# EAGLE design adc_dac_breakout (EAGLE 9.4.2)
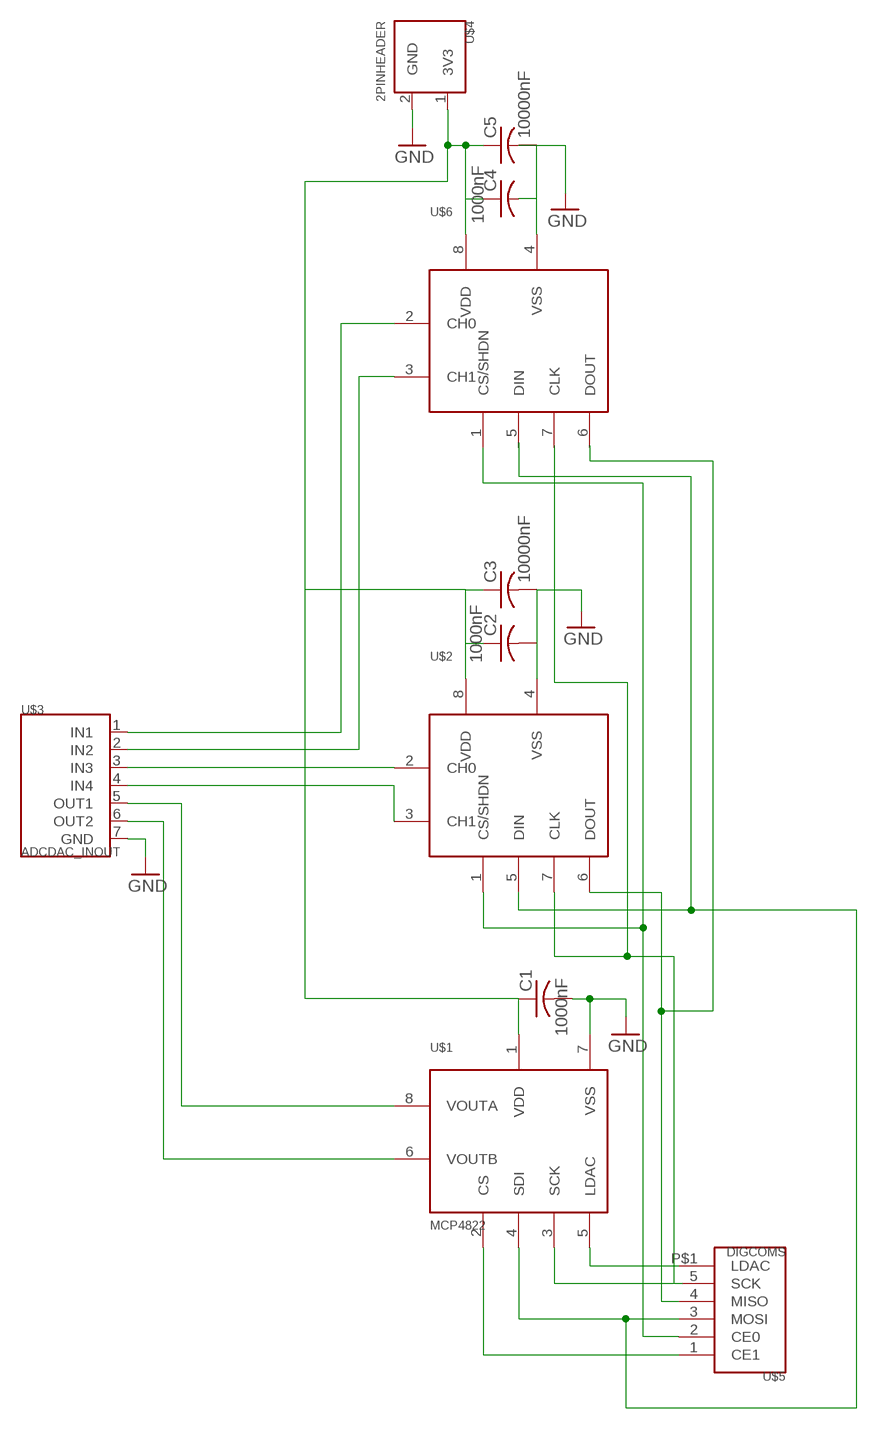
[diagram p0: schematic, sheet 1]

## Parts
C1  1000nF  C-USC0603  [C0603]
C2  1000nF  C-USC0603  [C0603]
C3  10000nF  C-USC0603  [C0603]
C4  1000nF  C-USC0603  [C0603]
C5  10000nF  C-USC0603  [C0603]
U$1  MCP4822  [MCP4822]
U$2  MCP3202  [MCP3202]
U$3  ADCDAC_INOUT  [7PINHEADER]
U$4  2PINHEADER  [2PINHEADER]
U$5  DIGCOMS  [6PINHEADER]
U$6  MCP3202  [MCP3202]

## Nets
GND: C1.2 U$1.7(VSS) U$3.7(GND) U$4.2(GND)
N$1: U$1.2(CS) U$5.1(CE1)
N$2: U$1.8(VOUTA) U$3.5(OUT1)
N$3: U$1.6(VOUTB) U$3.6(OUT2)
N$4: U$1.4(SDI) U$2.5(DIN) U$5.3(MOSI)
N$5: U$1.3(SCK) U$5.5(SCK)
N$6: U$1.5(LDAC) U$5.P$1(LDAC)
N$7: U$2.1(CS/SHDN) U$5.2(CE0) U$6.1(CS/SHDN)
N$8: C2.2 C3.2 U$2.4(VSS) ; supply symbol labelled GND
N$9: U$2.3(CH1) U$3.4(IN4)
N$10: C4.2 C5.2 U$6.4(VSS) ; supply symbol labelled GND
N$11: U$2.2(CH0) U$3.3(IN3)
N$12: U$3.2(IN2) U$6.3(CH1)
N$13: U$3.1(IN1) U$6.2(CH0)
N$15: U$2.6(DOUT) U$5.4(MISO)
N$17: U$2.7(CLK) U$6.7(CLK)
N$20: C1.1 C2.1 C3.1 C4.1 C5.1 U$1.1(VDD) U$2.8(VDD) U$4.1(3V3) U$6.8(VDD)
Unconnected: U$6.5(DIN) U$6.6(DOUT)

## Library data of the parts
C1-C5 = rcl:C-US: CAPACITOR, American symbol; SPICEPREFIX: C
U$1 = seds:MCP4822
U$2 U$6 = seds:MCP3202
U$3 = seds:ADCDAC_INOUT
U$4 = seds:2PINHEADER
U$5 = seds:DIGCOMS

## Board
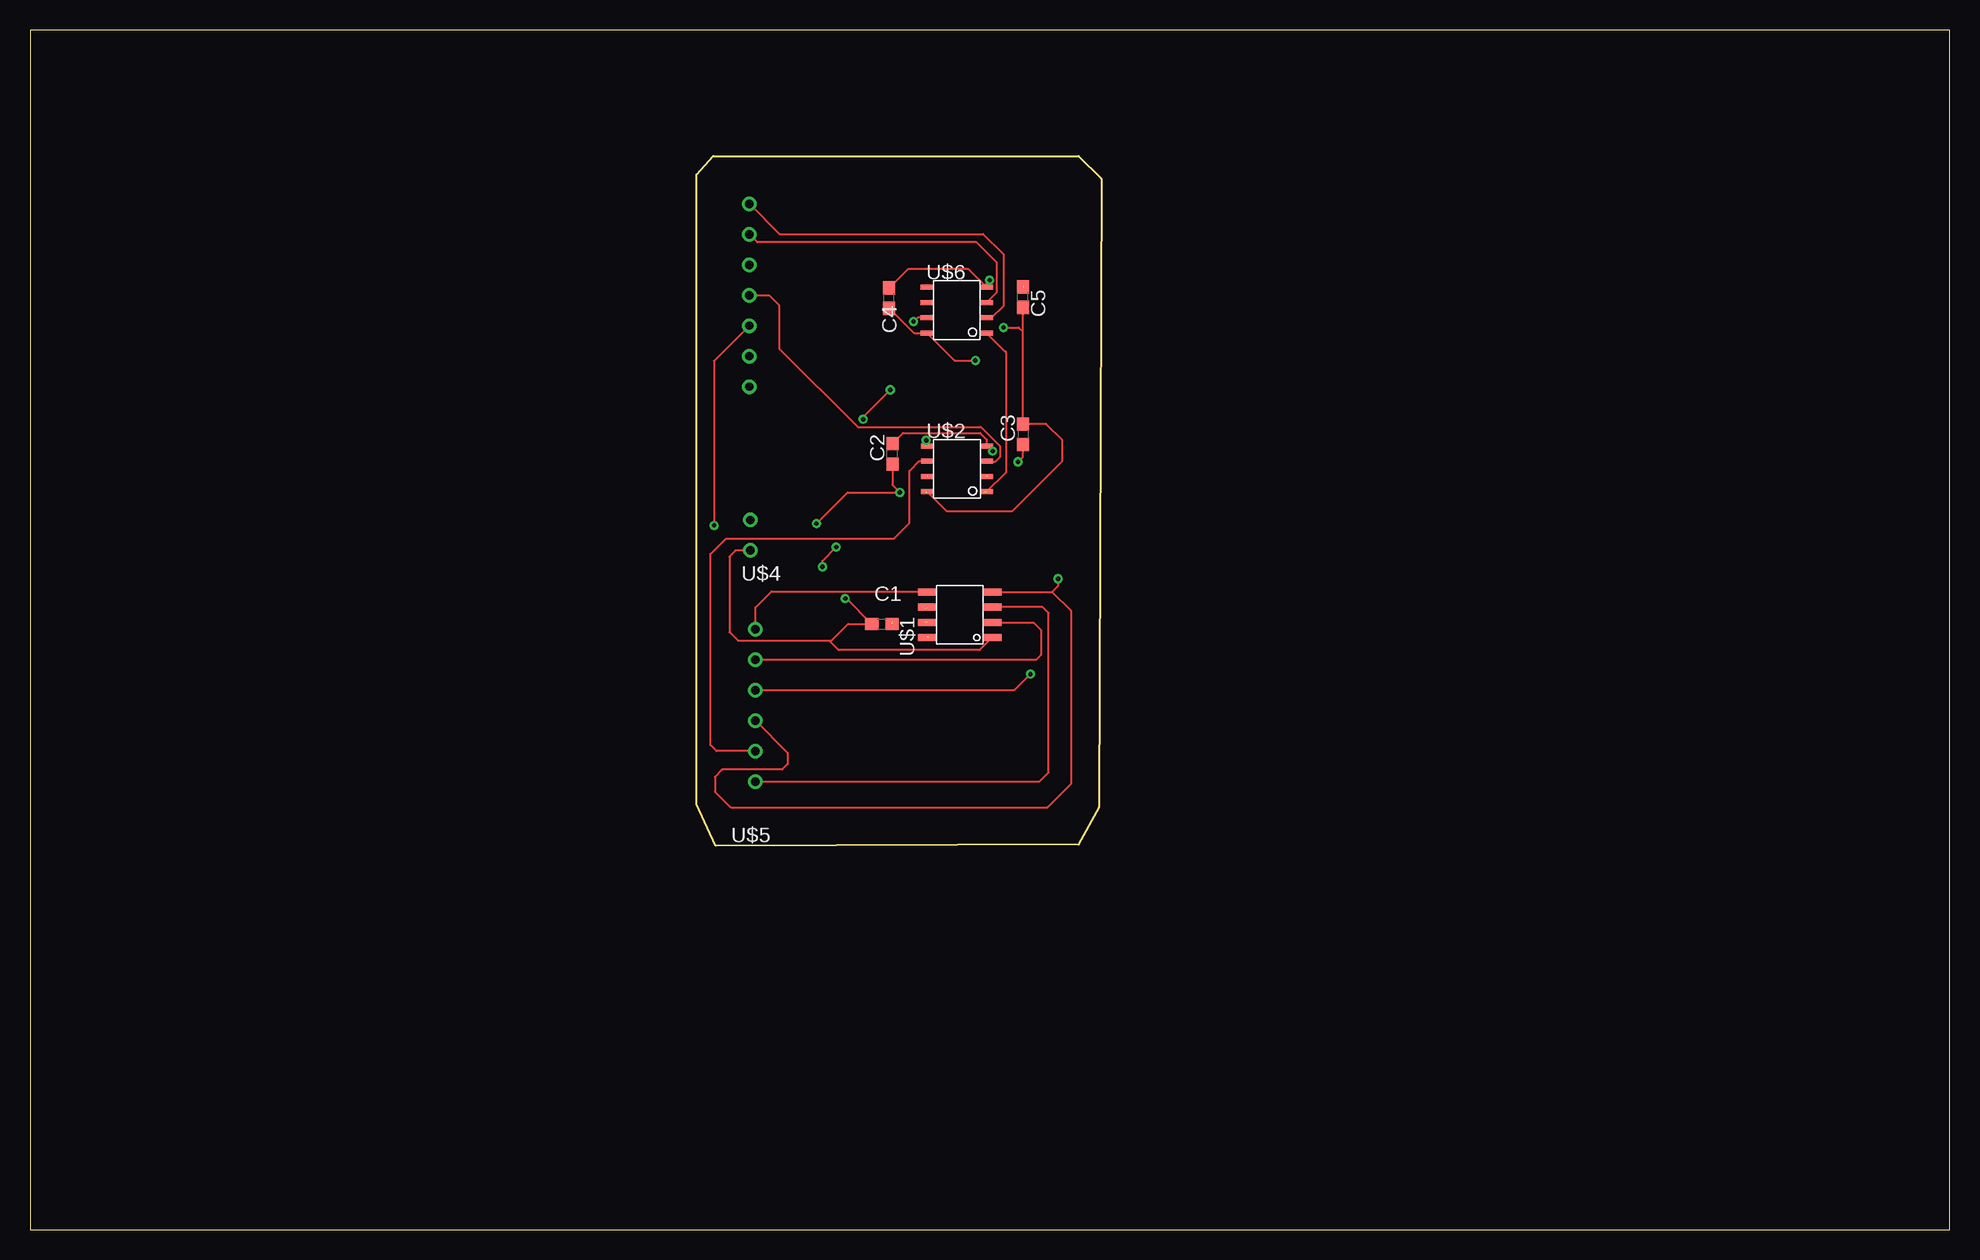
[diagram p1: board, top side]
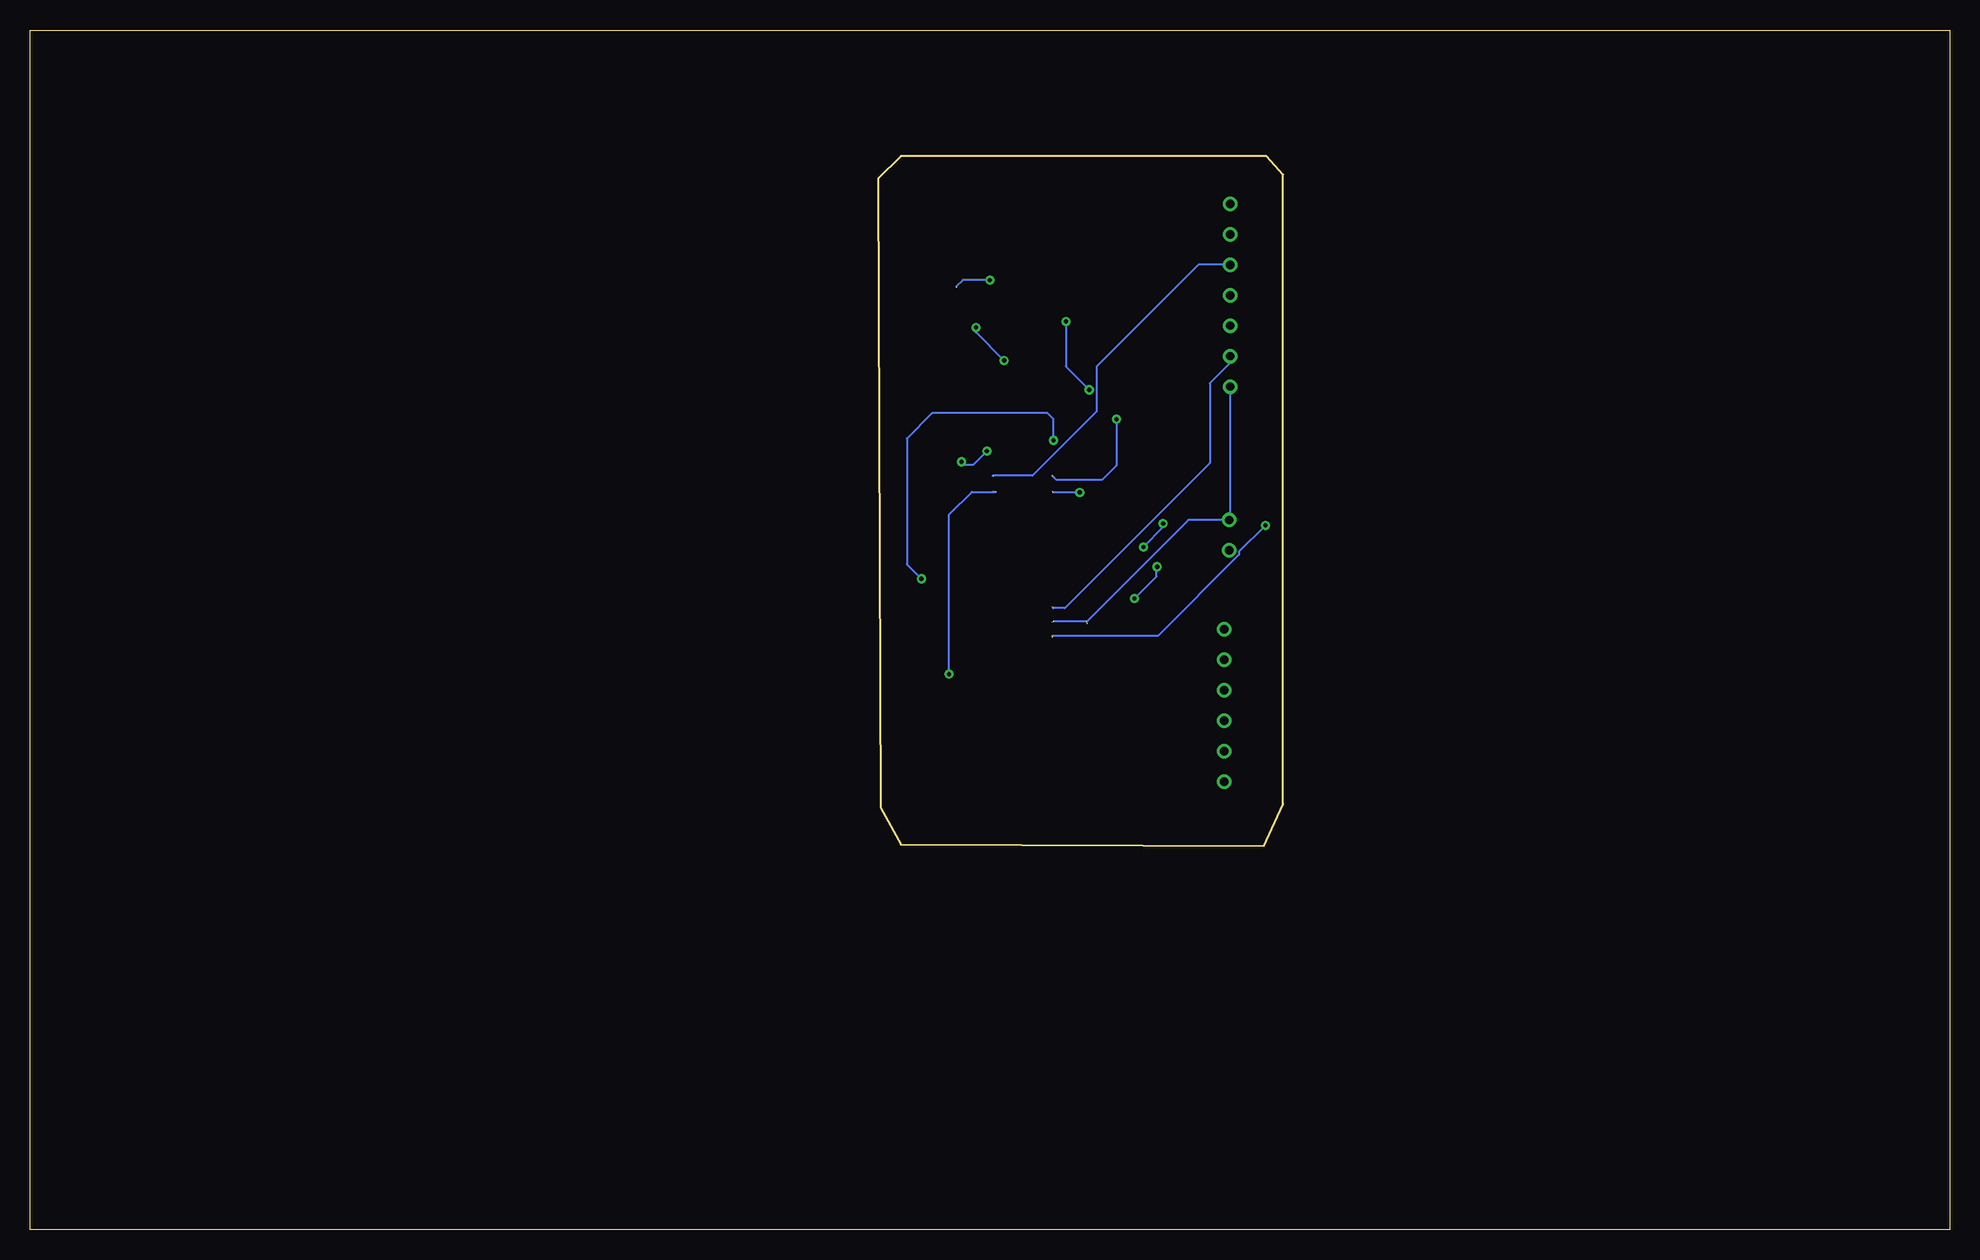
[diagram p2: board, bottom side, seen from below]

Size 160 x 100 mm. Coordinates in mm from the lower left corner, seen from the top.
Outline: 0,0 160,0 160,100 0,100 0,0
Outline: 56.95,89.5 87.4,89.5 89.3,87.6 89.1,35.2 87.4,32.1 57.15,32 55.55,35.45 55.55,87.95 56.95,89.5
Copper layers (1*16): Top 0.035mm / dielectric 1.5mm / Bottom 0.035mm
Design rules "default": minimum track width 6mil, minimum drill 0.35mm, track to track 6mil, track to pad 6mil, pad to pad 6mil, via to via 6mil, smd to smd 6mil, copper to edge 40mil, drill to drill 6mil, minimum pad ring 10mil, minimum via ring 8mil, stop-mask expansion 4mil, vias tented up to drill 0mil, thermal gap 10mil

### Footprints (pad centres in the part's own frame; a part is rotated, then mirrored left to right if it is on the bottom)
C0603 = smd 1.1 x 1: 1 -0.85,0; 2 0.85,0
MCP4822 = smd 0.6 x 1.55: 1 -1.905,-2.7; 2 -0.635,-2.7; 3 0.635,-2.7; 4 1.905,-2.7; 5 1.905,2.7; 6 0.635,2.7; 7 -0.635,2.7; 8 -1.905,2.7
MCP3202 = smd 1.055 x 0.42: 1 2.482,-1.905; 2 2.482,-0.635; 3 2.482,0.635; 4 2.482,1.905; 5 -2.482,1.905; 6 -2.482,0.635; 7 -2.482,-0.635; 8 -2.482,-1.905
7PINHEADER = drill 0.7: 1 0,5.08; 2 0,2.54; 3 0,0; 4 0,-2.54; 5 0,-5.08; 6 0,-7.62; 7 0,-10.16
2PINHEADER = drill 0.7: 1 0,2.54; 2 0,0
6PINHEADER = drill 0.7: 1 0,5.08; 2 0,2.54; 3 0,0; 4 0,-2.54; 5 0,-5.08; P$1 0,7.62

### Placement (x,y rotation side)
C1  71.01,50.48 0 top
C2  71.88,64.67 90 top
C3  82.76,66.3 270 top
C4  71.62,77.65 90 top
C5  82.75,77.73 90 top
U$1  77.5,51.25 90 top
U$2  77.26,63.42 0 top
U$3  59.97,80.43 0 top
U$4  60.05,59.15 180 top
U$5  60.47,42.42 0 top
U$6  77.25,76.65 0 top

### Tracks (layer width: path | path; a pad name or v marks a point on that pad's centre or on a via)
GND  (2 unrouted)
  Bottom 0.152: 74.65,50.7 71.9,50.7 63.45,59.15 U$4.2 59.97,59.23 U$3.7
N$1
  Top 0.152: U$1.2 80.22,50.6 83.65,50.6 84.25,50 84.25,47.9 83.85,47.5 U$5.1
N$2  (via drill 0.35)  (1 unrouted)
  Top 0.152: U$3.5 57.02,72.4 v57.02,58.7
  Bottom 0.152: v57.02,58.7 59.22,56.5 59.22,56.27 65.98,49.5 74.8,49.5
N$3  (1 unrouted)
  Bottom 0.152: U$3.6 59.97,72.23 61.65,70.55 61.65,63.9 73.75,51.8 74.7,51.8
N$4  (via drill 0.35)
  Top 0.152: U$1.4 85.19,53.16 | 85.19,53.16 86.8,51.55 86.8,37.2 84.8,35.2 58.4,35.2 57.1,36.5 57.1,37.75 57.7,38.35 62.7,38.35 63.15,38.8 63.15,39.74 U$5.3 | U$2.5 74.78,65.72 v74.7,65.79 | v85.7,54.25 85.7,53.66 85.19,53.16
  Bottom 0.152: v74.7,65.79 74.7,67.55 75.2,68.05 84.8,68.05 86.9,65.95 86.9,55.45 v85.7,54.25
N$5
  Top 0.152: U$5.5 84.14,37.34 84.9,38.1 84.9,51.4 84.42,51.88 U$1.3
N$6
  Top 0.152: U$5.P$1 60.47,51.87 61.8,53.2 74.75,53.2 U$1.5
N$7  (via drill 0.35)  (1 unrouted)
  Top 0.152: U$2.1 81.35,63.12 81.35,73.2 81.28,73.2 U$6.1 | U$5.2 82.06,44.96 v83.4,46.3
  Bottom 0.152: v83.4,46.3 83.4,59.6 81.5,61.5 79.5,61.5
N$8  (via drill 0.35)
  Top 0.152: C2.2 72.76,66.4 79.2,66.4 79.74,65.86 U$2.4 80.17,64.9 v80.24,64.9 | C3.2 82.76,64.41 v82.35,64
  Bottom 0.152: v80.24,64.9 81.39,63.75 82.1,63.75 v82.35,64
N$9
  Top 0.152: U$3.4 61.61,77.89 62.45,77.05 62.45,73.45 69,66.9 79.25,66.9 80.85,65.3 80.85,64.4 80.45,64 79.8,64 U$2.3
N$10  (via drill 0.35)  (1 unrouted)
  Top 0.152: C4.2 73.22,80.1 78.19,80.1 U$6.4 79.73,78.89 v79.99,79.15
  Bottom 0.152: v79.99,79.15 82.25,79.15 82.8,78.6
N$11  (1 unrouted)
  Bottom 0.152: U$3.3 62.62,80.43 71.1,71.95 71.1,68.2 76.45,62.85 79.75,62.85
N$12
  Top 0.152: U$6.3 80.6,78.15 80.6,80.6 78.9,82.3 60.64,82.3 U$3.2
N$13
  Top 0.152: U$3.1 62.48,83 79.45,83 81.15,81.3 81.15,77 80.17,76.02 U$6.2
N$15
  Top 0.152: U$5.4 57.22,39.88 56.72,40.38 56.72,56.32 58,57.6 72,57.6 73.3,58.9 73.3,63.25 74.11,64.06 U$2.6
N$17  (via drill 0.35)  (1 unrouted)
  Top 0.152: U$6.7 73.97,76.02 v73.65,75.7 | v71.71,70 69.45,67.74 v69.45,67.55
  Bottom 0.152: v73.65,75.7 73.65,71.94 v71.71,70 | v69.45,67.55 69.45,63.7 70.65,62.5 74.45,62.5 74.8,62.85
N$20  (via drill 0.35)  (1 unrouted)
  Top 0.152: U$4.1 58.81,56.61 58.3,56.1 58.3,49.8 59,49.1 66.6,49.1 | 66.6,49.1 66.8,49.1 68.2,50.5 70.14,50.5 | C1.1 70.14,50.5 | U$1.1 79.16,48.3 67.4,48.3 66.6,49.1 | C4.1 73.67,74.75 U$6.8 77.06,72.45 v78.8,72.45 | 82.75,74.85 C3.1 84.7,67.15 86.05,65.8 86.05,64.05 81.9,59.9 76.39,59.9 U$2.8 | 82.75,74.85 C5.1 | C2.1 71.88,62.07 v72.5,61.45 68.15,61.45 v65.55,58.85 | v81.15,75.2 82.4,75.2 82.75,74.85 | 70.14,50.5 68.05,52.59 v67.95,52.59 | v66.05,55.25 66.05,55.75 v67.2,56.9
  Bottom 0.152: v72.5,61.45 74.7,61.45 | v78.8,72.45 81.15,74.8 v81.15,75.2 | v67.95,52.59 66.1,54.44 66.1,55.25 v66.05,55.25 | v67.2,56.9 65.55,58.55 v65.55,58.85